# EAGLE schematic TranCT (EAGLE 6.4)
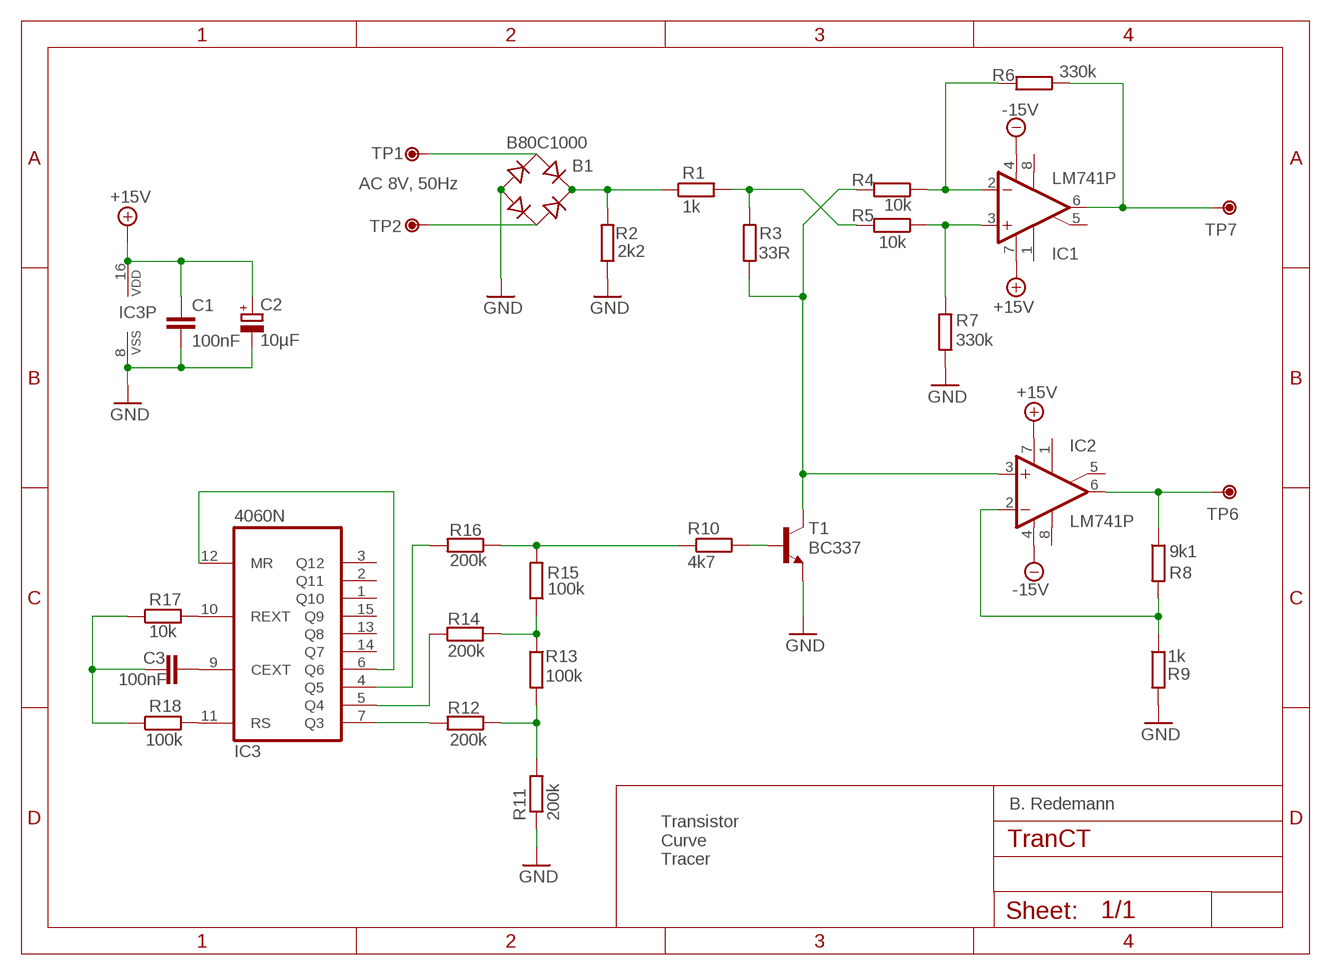
[diagram p0: schematic, sheet 1]

## Parts
B1  B80C1000  B-DIL  [B-DIL]
C1  100nF  C-EU025-024X044  [C025-024X044]
C2  10µF  CPOL-EUA  [PANASONIC_A]
C3  100nF  C-EU025-024X044  [C025-024X044]
IC1  LM741P  [DIL08]
IC2  LM741P  [DIL08]
IC3  4060N  [DIL16]
R1  1k  R-EU_0204/7  [0204/7]
R2  2k2  R-EU_0204/7  [0204/7]
R3  33R  R-EU_0204/7  [0204/7]
R4  10k  R-EU_0204/7  [0204/7]
R5  10k  R-EU_0204/7  [0204/7]
R6  330k  R-EU_0204/7  [0204/7]
R7  330k  R-EU_0204/7  [0204/7]
R8  9k1  R-EU_0204/7  [0204/7]
R9  1k  R-EU_0204/7  [0204/7]
R10  4k7  R-EU_0204/7  [0204/7]
R11  200k  R-EU_0204/7  [0204/7]
R12  200k  R-EU_0204/7  [0204/7]
R13  100k  R-EU_0204/7  [0204/7]
R14  200k  R-EU_0204/7  [0204/7]
R15  100k  R-EU_0204/7  [0204/7]
R16  200k  R-EU_0204/7  [0204/7]
R17  10k  R-EU_0204/7  [0204/7]
R18  100k  R-EU_0204/7  [0204/7]
T1  BC337  [TO92]
TP1  TPB1,27  [B1,27]
TP2  TPB1,27  [B1,27]
TP6  TPB1,27  [B1,27]
TP7  TPB1,27  [B1,27]

## Nets
+15V: C1.1 C2.+ IC1.7(V+) IC2.7(V+) IC3.16(VDD)
-15V: IC1.4(V-) IC2.4(V-)
GND: B1.- C1.2 C2.- IC3.8(VSS) R2.1 R7.2 R9.2 R11.1 T1.1(E)
N$1: B1.+ R1.1 R2.2
N$2: B1.AC1 TP1.TP
N$3: B1.AC2 TP2.TP
N$4: R1.2 R3.2 R5.2
N$5: IC1.2(-IN) R4.1 R6.2
N$6: IC1.3(+IN) R5.1 R7.1
N$7: R11.2 R12.1 R13.2
N$8: IC2.3(+IN) R3.1 R4.2 T1.3(C)
N$9: IC1.6(OUT) R6.1 TP7.TP
N$10: IC2.6(OUT) R8.1 TP6.TP
N$11: IC2.2(-IN) R8.2 R9.1
N$12: R10.2 T1.2(B)
N$13: R13.1 R14.2 R15.1
N$14: R10.1 R15.2 R16.1
N$15: IC3.7(Q3) R12.2
N$16: IC3.5(Q4) R14.1
N$17: IC3.4(Q5) R16.2
N$18: IC3.6(Q6) IC3.12(MR)
N$19: C3.2 IC3.9(CEXT)
N$20: IC3.10(REXT) R17.2
N$21: IC3.11(RS) R18.2
N$22: C3.1 R17.1 R18.1
Unconnected: IC1.1(ON1) IC1.5(ON2) IC1.8(OPT) IC2.1(ON1) IC2.5(ON2) IC2.8(OPT) IC3.1(Q10) IC3.2(Q11) IC3.3(Q12) IC3.13(Q8) IC3.14(Q7) IC3.15(Q9)

## Notes on the sheet
- AC 8V, 50Hz
- B. Redemann
- Transistor
  Curve
  Tracer

## Library data of the parts
B1 = rectifier:B-DIL: RECTIFIER
C1 C3 = resistor:C-EU: CAPACITOR, European symbol
C2 = resistor:CPOL-EU: POLARIZED CAPACITOR, European symbol
IC1 IC2 = linear:*741: OP AMP
IC3 = 40xx:4060: 14-stage binary/ripple COUNTER
R1-R18 = resistor:R-EU_: RESISTOR, European symbol
T1 = transistor:BC337: NPN TRANSISTOR
TP1 TP2 TP6 TP7 = testpad:TP: Test pad